# EasyEDA Pro project Vue receiver v1.0.epro

# Board PCB2
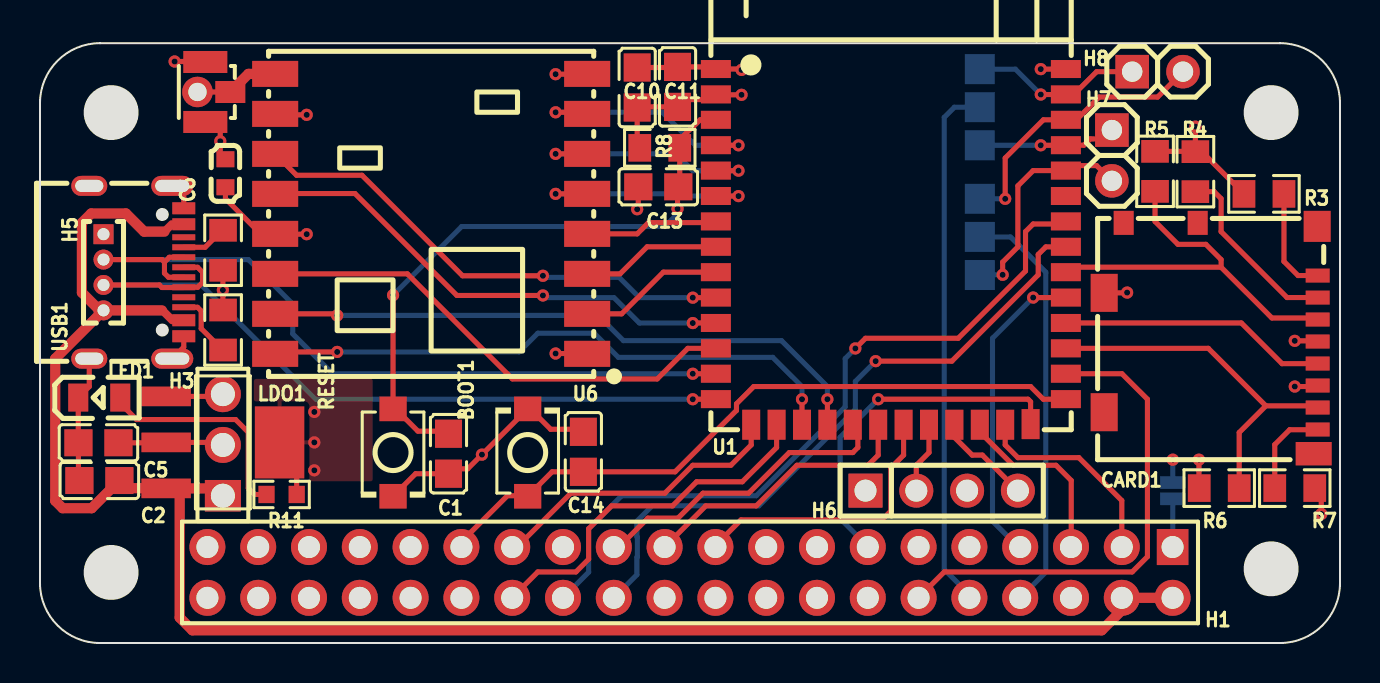
[diagram p0: board, top side]
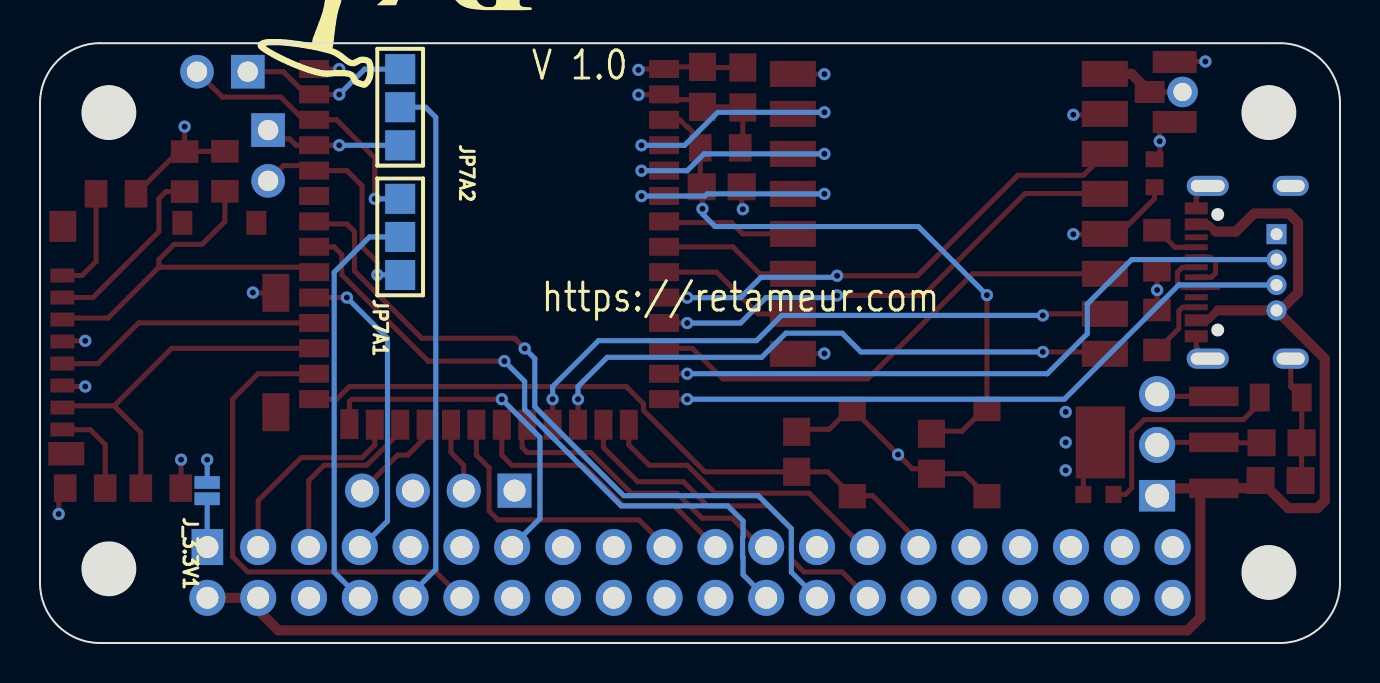
[diagram p1: board, bottom side, seen from below]

Outline 65 x 30 mm; copper layers: Top Layer, Inner1, Inner2, Bottom Layer. Coordinates in mm from the lower left corner of the outline.
Outline path: 0,27 0,3 arc(0.88,0.88) 3,0 62,0 arc(64.12,0.88) 65,3 65,27 arc(64.12,29.12) 62,30 3,30 arc(0.88,29.12) 0,27
Stack: Top Layer 0.035mm Outer layer copper thickness 1oz / Dielectric1 0.2104mm 7628 RC49% 8.6mil / Inner1 0.0152mm Inner layer copper thickness / Dielectric2 1.065mm 1.1mm H/HOZ Copper / Inner2 0.0152mm Inner layer copper thickness / Dielectric3 0.2104mm 7628 RC49% 8.6mil / Bottom Layer 0.035mm Outer layer copper thickness 1oz

## Design rules (mm)
net D-: DP1
net D+: DP1
template: Custom Config
spacing copperThickness1oz (default): track to track 0.102, other pairs 0.152 to 0.3
spacing copperThickness2oz: track to track 0.203, other pairs 0.152 to 0.3
track width copperThickness1oz (default): min 0.127, default 0.254, max 2.54
track width copperThickness2oz: min 0.203, default 0.254, max 2.54
differential pair differentialPair (default): width min 0.127, default 0.254, max 2.54; gap min 0.152, default 0.152
via viaSize (default): diameter min 0.5, default 0.61, max 10; hole min 0.3, default 0.305, max 6.3

## Placement (name value [footprint] x y rotation side)
BOOT1  TS-1088-AR02016  [SW-SMD_L3.9-W3.0-P4.45]  24.38 9.53 90 top
C1  100nF  [C0805]  20.43 9.47 90 top
C2  1uF  [C0805]  2.97 8.13 180 top
C5  4.7nF  [C0805]  2.92 10.01 180 top
C6  100nF  [C0603]  9.27 23.5 90 top
C10  100nF  [C0805]  29.86 27.78 270 top
C11  10uF  [C0805]  31.88 27.81 270 top
C13  1uF  [C0805]  30.91 22.82 0 top
C14  100nF  [C0805]  27.17 9.56 270 top
CARD1  1040310811  [SIM-SMD_8P-1040310811]  58.55 15.24 90 top
H1  2.54mm 2*20P直排针  [HDR-TH_40P-P2.54-V-M-R2-C20-S2.54]  32.5 3.53 180 top
H3  2.54-1*3P针  [HDR-TH_3P-P2.54-V-M-1]  9.14 9.91 90 top
H5  PZ127V-11-04-0720  [HDR-TH_4P-P1.27-V-M]  3.17 18.54 270 top
H6  PZ254V-11-04P  [HDR-TH_4P-P2.54-V-M]  45.09 7.62 0 top
H7  -  [PIN HEADER 1X2]  53.59 25.65 270 top
H8  -  [PIN HEADER 1X2]  54.61 28.58 0 top
J_3.3V1  J_3.3V  [SPARKFUN-JUMPERS_SMT-JUMPER_2_NC_PASTE_NO-SILK]  56.64 7.62 90 bottom
JP1  U.FL-R-SMT-1(10)  [ANT-SMD_UFL-R-SMT-1-10]  8.89 27.56 180 top
JP7A1  -  [Raemixx500:Jumper3-Open]  46.99 20.31 90 bottom
JP7A2  -  [Raemixx500:Jumper3-Open]  46.99 26.8 90 bottom
LDO1  LDL1117S33R  [SOT-223-4_L6.5-W3.5-P2.30-LS7.0-BR]  9.14 10.03 180 top
LED1  NCD0805R1  [LED0805-R-RD]  2.96 12.27 0 top
NOREF  -  [Pad_e790]  7.87 27.56 0 top
R3  10kΩ  [R0805]  61.2 22.46 0 top
R4  10kΩ  [R0805]  57.77 23.57 270 top
R5  10kΩ  [R0805]  55.75 23.59 270 top
R6  10kΩ  [R0805]  58.96 7.75 0 top
R7  10kΩ  [R0805]  62.74 7.75 180 top
R8  10kΩ  [R0805]  30.99 24.77 0 top
R9  5.1Ω  [R0805]  9.15 15.65 270 top
R10  5.1Ω  [R0805]  9.15 19.64 270 top
R11  1kΩ  [R0603]  12.08 7.43 180 top
RESET  TS-1088-AR02016  [SW-SMD_L3.9-W3.0-P4.45]  17.65 9.53 270 top
U1  ESP32-S3-WROOM-1-N16R8  [WIRELM-SMD_ESP32-S3-WROOM-1]  42.54 19.81 0 top
U2  d80a42be568847e5bce024f4a243b5a7  [MOUNTING-HOLE-M2.5]  3.56 3.53 0 top
U3  d80a42be568847e5bce024f4a243b5a7  [MOUNTING-HOLE-M2.5]  3.56 26.53 0 top
U4  d80a42be568847e5bce024f4a243b5a7  [MOUNTING-HOLE-M2.5]  61.56 26.53 0 top
U5  d80a42be568847e5bce024f4a243b5a7  [MOUNTING-HOLE-M2.5]  61.56 3.71 0 top
U6  DL-RFM69HC-868M  [WIFIM-SMD_16P-L16.0-W16.0-P2.00]  19.56 21.46 90 top
USB1  TYPE-C 16PIN 3MD(385)  [USB-C-SMD_TYPE-C16PIN]  4.83 18.54 270 top

## Footprints (pads in the part's own frame, mm; a bottom-side part is the same pattern mirrored in y, then rotated)
ANT-SMD_UFL-R-SMT-1-10
  rect 2.2x1.1 smd: 1(0.625,1.5) 3(0.625,-1.5)
  rect 1.5x1.1 smd: 2(-0.625,0.001)
C0603
  rect 0.8x0.9 smd: 1(-0.7,0) 2(0.7,0)
C0805
  rect 1.41x1.35 smd: 1(-1,0) 2(1,0)
HDR-TH_3P-P2.54-V-M-1
  rect 1.575x1.8 hole 1.2: 1(-2.54,0)
  round 1.8 hole 1.2: 2(0,0) 3(2.54,0)
HDR-TH_4P-P1.27-V-M
  rect 1x1 hole 0.6: 1(-1.905,0)
  round 1 hole 0.6: 2(-0.635,0) 3(0.635,0) 4(1.905,0)
HDR-TH_4P-P2.54-V-M
  rect 1.7x1.7 hole 1.1: 1(-3.81,0)
  round 1.7 hole 1.1: 2(-1.27,0) 3(1.27,0) 4(3.81,0)
HDR-TH_40P-P2.54-V-M-R2-C20-S2.54
  rect 1.575x1.8 hole 1.1: 1(-24.13,-1.27)
  round 1.8 hole 1.1: 2(-24.13,1.27) 3(-21.59,-1.27) 4(-21.59,1.27) 5(-19.05,-1.27) 6(-19.05,1.27) 7(-16.51,-1.27) 8(-16.51,1.27) 9(-13.97,-1.27) 10(-13.97,1.27) 11(-11.43,-1.27) 12(-11.43,1.27) 13(-8.89,-1.27) 14(-8.89,1.27) 15(-6.35,-1.27) 16(-6.35,1.27) 17(-3.81,-1.27) 18(-3.81,1.27) 19(-1.27,-1.27) 20(-1.27,1.27) 21(1.27,-1.27) 22(1.27,1.27) 23(3.81,-1.27) 24(3.81,1.27) 25(6.35,-1.27) 26(6.35,1.27) 27(8.89,-1.27) 28(8.89,1.27) 29(11.43,-1.27) 30(11.43,1.27) 31(13.97,-1.27) 32(13.97,1.27) 33(16.51,-1.27) 34(16.51,1.27) 35(19.05,-1.27) 36(19.05,1.27) 37(21.59,-1.27) 38(21.59,1.27) 39(24.13,-1.27) 40(24.13,1.27)
LED0805-R-RD
  rect 1x1.399 smd: 1(1.05,0) 2(-1.05,0)
Pad_e790
  round 1.524 hole 0.914: 1(0,0)
PIN HEADER 1X2
  rect 1.677x1.677 hole 1.016: 1(0,0)
  round 1.677 hole 1.016: 2(2.54,0)
R0603
  rect 0.806x0.864 smd: 1(-0.753,0) 2(0.753,0)
R0805
  rect 1.133x1.377 smd: 1(-1,0) 2(1,0)
Raemixx500:Jumper3-Open
  rect 1.5x1.5 smd: 1(-1.905,0) 2(0,0) 3(1.905,0)
SIM-SMD_8P-1040310811
  rect 0.7x1.2 smd: 1(3.138,-5.338) 2(2.038,-5.338) 3(0.938,-5.338) 4(-0.163,-5.338) 5(-1.262,-5.338) 6(-2.362,-5.338) 7(-3.462,-5.338) 8(-4.562,-5.338)
  rect 1.17x1.8 smd: 9(-5.772,-5.138)
  rect 1.55x1.35 smd: 10(5.598,-5.312)
  rect 1.2x1 smd: 11(5.772,0.662) 12(5.772,4.362)
  rect 1.9x1.35 smd: 13(2.272,5.338) 14(-3.697,5.338)
SOT-223-4_L6.5-W3.5-P2.30-LS7.0-BR
  rect 2.47x0.98 smd: 1(2.835,-2.3) 2(2.835,0) 3(2.835,2.3)
  rect 2.47x3.6 smd: 4(-2.835,0)
SPARKFUN-JUMPERS_SMT-JUMPER_2_NC_PASTE_NO-SILK
  custom 0.635x1.27 smd: 1(-0.406,0) 2(0.406,0)
SW-SMD_L3.9-W3.0-P4.45
  rect 1.23x1.36 smd: 1(-2.185,0) 2(2.185,0)
USB-C-SMD_TYPE-C16PIN
  oval 1x2.1 hole 0.6x1.7: 1(-4.32,1.788) 2(4.32,1.788)
  oval 1x1.8 hole 0.6x1.4: 3(-4.32,-2.362) 4(4.32,-2.362)
  rect 0.6x1.15 smd: A1B12(-3.2,2.362) A4B9(-2.4,2.362) B1A12(3.2,2.362) B4A9(2.4,2.362)
  rect 0.3x1.15 smd: A5(-1.25,2.362) A6(-0.25,2.362) A7(0.25,2.362) A8(-1.75,2.362) B5(1.75,2.362) B6(0.75,2.362) B7(-0.75,2.362) B8(1.25,2.362)
WIFIM-SMD_16P-L16.0-W16.0-P2.00
  rect 1.3x2.3 smd: 1(-7,-7.8) 2(-5,-7.8) 3(-3,-7.8) 4(-1,-7.8) 5(1,-7.8) 6(3,-7.8) 7(5,-7.8) 8(7,-7.8) 9(7,7.8) 10(5,7.8) 11(3,7.8) 12(1,7.8) 13(-1,7.8) 14(-3,7.8) 15(-5,7.8) 16(-7,7.8)
WIRELM-SMD_ESP32-S3-WROOM-1
  rect 1.5x0.9 smd: 1(-8.75,8.895) 2(-8.75,7.625) 3(-8.75,6.355) 4(-8.75,5.085) 5(-8.75,3.815) 6(-8.75,2.545) 7(-8.75,1.275) 8(-8.75,0.005) 9(-8.75,-1.265) 10(-8.75,-2.535) 11(-8.75,-3.805) 12(-8.75,-5.075) 13(-8.75,-6.345) 14(-8.75,-7.615) 27(8.75,-7.615) 28(8.75,-6.345) 29(8.75,-5.075) 30(8.75,-3.805) 31(8.75,-2.535) 32(8.75,-1.265) 33(8.75,0.005) 34(8.75,1.275) 35(8.75,2.545) 36(8.75,3.815) 37(8.75,5.085) 38(8.75,6.355) 39(8.75,7.625) 40(8.75,8.895)
  rect 0.9x1.5 smd: 15(-6.985,-8.895) 16(-5.715,-8.895) 17(-4.445,-8.895) 18(-3.175,-8.895) 19(-1.905,-8.895) 20(-0.635,-8.895) 21(0.635,-8.895) 22(1.905,-8.895) 23(3.175,-8.895) 24(4.445,-8.895) 25(5.715,-8.895) 26(6.985,-8.865)

## Nets
+3.3V: C5.1 C6.1 C10.2 C11.2 CARD1.4 H3.2 H6.1 J_3.3V1.2 LDO1.2 LDO1.4 R3.1 R4.1 R5.1 R6.1 R7.1 R8.1 R11.1 U1.2 U6.13
+5V: C2.1 H1.2 H1.4 H3.1 H5.4 LDO1.3 USB1.A4B9 USB1.B4A9
GND: BOOT1.2 C1.1 C2.2 C5.2 C6.2 C10.1 C11.1 C13.1 C14.1 CARD1.6 CARD1.13 H1.6 H1.9 H1.14 H1.20 H1.25 H1.30 H1.34 H1.39 H3.3 H5.1 H6.3 JP1.1 JP1.3 LDO1.1 LED1.2 R9.1 R10.2 RESET.2 U1.1 U1.40 U6.1 U6.8 U6.10 USB1.1 USB1.2 USB1.3 USB1.4 USB1.A1B12 USB1.B1A12
1_WIRE: H1.7 U1.31
ANT: JP1.2 NOREF.1 U6.9
BRIGDE_3.3: H1.1 H1.17 J_3.3V1.1
D+: H5.3 U1.14 USB1.A6 USB1.B6
D-: H5.2 U1.13 USB1.A7 USB1.B7
DIO0: U1.12 U6.14
DIO1: U1.18 U6.15
DIO2: U1.17 U6.16
DIO3: U1.10 U6.11
DIO4: U1.11 U6.12
DIO5: U1.4 U6.7
EN: C1.2 C13.2 R8.2 RESET.1 U1.3
GPIO0: BOOT1.1 C14.2 H1.29 U1.27
GPIO3: H1.27 U1.15
GPIO14: H6.2 U1.22
GPIO21: H6.4 U1.23
GPIO35: H1.12 U1.28
GPIO45: H1.13 U1.26
GPIO46: H1.28 U1.16
I2C_SCL1: H1.5 U1.24
I2C_SDA0: H1.3 U1.25
MISO: U1.9 U6.2
MOSI: U1.8 U6.3
RESET: U1.5 U6.6
RXD0: H7.2 JP7A1.1 U1.36
RXD1: H8.2 JP7A1.3 U1.38
SCK: U1.7 U6.4
SD_CLK: CARD1.5 U1.30
SD_CMD: CARD1.3 R5.2 U1.32
SD_DATA0: CARD1.7 R6.2 U1.29
SPI2_CS0: H1.24 U1.33
SPI2_CS1: H1.26 U1.34
SPI2_MISO: H1.21 U1.20
SPI2_MOSI: H1.19 U1.21
SPI2_SCLK: H1.23 U1.19
SS: U1.6 U6.5
TXD0: H7.1 JP7A2.1 U1.37
TXD1: H8.1 JP7A2.3 U1.39
$1N677: H1.11
$1N3033: CARD1.8 R7.2
$1N3034: CARD1.2 R4.2
$1N3035: CARD1.1 R3.2
$1N3426: R10.1 USB1.A5
$1N3427: R9.2 USB1.B5
$1N3817: LED1.1 R11.2
$1N4970: H1.8 JP7A1.2
$1N4972: H1.10 JP7A2.2

Pads without a net: CARD1 9 10 11 12 14; H1 15 16 18 22 31 32 33 35 36 37 38 40; U1 35; USB1 A8 B8

## Via types
v1: diameter 0.61, hole 0.305, Top Layer to Bottom Layer, 48 vias

## Routing (per net, layer and track width the routed paths; a pad name or vN(x,y) marks a point on that pad's centre or on a via; arc(x,y) is an arc through that point)
+3.3V: length 32.9
  Top Layer w0.254: H3.2 9.02,10.03 6.31,10.03 6.29,10.01 C5.1 ; R8.1 29.86,24.89 C10.2 29.89,26.81 C11.2 32.24,27.18 33.54,27.18 U1.2 33.81,27.42 v1(35.08,27.42) ; v1(64.06,6.45) 64.06,7.42 R7.1 ; LDO1.4 12.83,9.18 R11.1 ; R3.1 58.09,24.57 R4.1 ; R4.1 v1(57.77,25.83) ; R4.1 57.75,24.59 R5.1 ; C6.1 9.27,22.22 11.03,20.46 U6.13 11.77,20.45 v1(13.34,20.45) ; R6.1 57.95,7.76 v1(57.95,9.17) ; v1(62.74,15.11) 63.92,15.11
  Bottom Layer w0.254: v1(56.64,9.17) J_3.3V1.2
  vias: v1(13.72,11.56) v1(13.72,10.03) v1(13.72,8.64)
+5V: length 90.5
  Top Layer w0.4: 6.12,16.64 6.62,16.14 ; 6.59,20.94 6.22,20.57
  Top Layer w0.508: C2.1 2.58,6.74 1.13,6.74 0.76,7.11 0.76,14.22 H5.4 ; H5.4 6.1,16.64 ; H5.4 2.98,16.64 2.1,17.53 2.1,21.02 2.56,21.48 4.3,21.48 5.21,20.57 6.22,20.57 ; 6.31,7.73 8.78,7.73 H3.1 ; H1.2 H1.4 54.09,1.64 53.09,0.64 7.62,0.64 6.98,1.27 6.98,7.24 ; 3.97,7.74 6.3,7.74
GND: length 43.7
  Top Layer w0.254: C10.1 31.85,28.78 C11.1 33.69,28.81 U1.1 35.03,28.71 v1(35.08,28.66) ; CARD1.13 54.34,17.51 v1(54.36,17.53) ; 9.03,16.65 9.15,16.77 9.15,18.52 9.03,18.64 ; U6.8 27.34,28.45 v1(25.78,28.45) ; v1(29.86,21.69) 29.91,21.75 C13.1 ; 6.31,12.33 9.03,12.33 H3.3 ; USB1.1 7.19,22.29 USB1.A1B12 ; USB1.2 7.19,14.8 USB1.B1A12 ; U6.1 27.34,14.48 v1(25.78,14.48) ; C1.1 18.78,8.47 RESET.2 ; C6.2 9.01,24.45 v1(9.01,25.09) 9.01,25.91 ; v1(13.34,26.42) 11.81,26.42 U6.10 ; USB1.4 2.46,12.83 LED1.2 1.91,10.02 C5.2 1.92,7.79 1.97,7.74 ; 24.38,11.84 25.53,10.69 27.17,10.69 ; JP1.3 8.24,29.08 v1(6.73,29.08) ; v1(62.74,12.83) 63.96,12.83 ; v1(50.04,28.7) 51.29,28.7 U1.40 ; 21.03,8.71 21.39,8.71 v1(22.1,9.42) BOOT1.2
  vias: v1(9.14,17.65)
1_WIRE: length 15.6
  Top Layer w0.254: U1.31 v1(49.66,17.28)
  Bottom Layer w0.254: v1(49.66,17.28) 47.62,15.25 47.62,6.1 48.92,4.8 49.01,4.8
ANT: length 4.3
  Top Layer w0.254: JP1.2 7.88,27.56
  Top Layer w0.508: JP1.2 10.42,28.46 U6.9
BRIGDE_3.3: length 23.8
  Inner2 w0.254: 36.31,4.8 36.31,4.71 37.47,3.56 55.39,3.56 56.63,4.8
  Bottom Layer w0.254: J_3.3V1.1 56.64,4.81 56.63,4.8
D+: length 39.7
  Top Layer w0.254: v1(32.64,12.19) 33.79,12.19 U1.14 ; H5.3 5.97,17.91 6.1,17.78 7.18,17.78 USB1.B6 7.89,17.79 8.13,18.03 8.13,18.54 7.88,18.79 USB1.A6
  Bottom Layer w0.254: v1(32.64,12.19) 13.78,12.19 8.06,17.91 H5.3
D-: length 39.6
  Top Layer w0.254: 6.22,19.05 6.1,19.18 H5.2 ; 6.22,19.05 6.47,19.29 USB1.B7 ; 6.22,19.05 6.22,18.5 6.43,18.29 USB1.A7 ; U1.13 v1(32.64,13.47)
  Bottom Layer w0.254: v1(32.64,13.47) 14.63,13.47 12.64,15.46 12.64,16.95 10.41,19.18 H5.2
DIO0: length 24.8
  Top Layer w0.254: U1.12 32.39,14.74 30.86,13.21 23.62,13.21 18.37,18.46 U6.14
DIO1: length 31
  Top Layer w0.254: v1(39.37,12.19) U1.18 ; v1(14.86,16.38) 14.78,16.46 U6.15
  Bottom Layer w0.254: v1(39.37,12.19) 39.37,12.83 37.07,15.12 29.17,15.12 27.91,16.38 v1(14.86,16.38)
DIO2: length 29.8
  Top Layer w0.254: U6.16 11.85,14.56 v1(14.86,14.56) ; v1(38.1,12.19) U1.17
  Bottom Layer w0.254: v1(14.86,14.56) 23.96,14.56 24.89,15.49 27.71,15.49 28.92,14.29 36.64,14.29 38.1,12.83 v1(38.1,12.19)
DIO3: length 25
  Top Layer w0.254: v1(32.64,17.27) 33.79,17.27 U1.10 ; v1(25.15,18.37) 21.13,18.37 16.1,23.39 12.83,23.39 U6.11
  Bottom Layer w0.254: v1(32.64,17.27) 29.97,17.27 28.96,18.29 25.22,18.29 v1(25.15,18.37)
DIO4: length 24.7
  Top Layer w0.254: 33.79,16.01 32.64,16.01 v1(32.64,16) ; U6.12 11.77,22.48 15.75,22.48 20.84,17.38 v1(25.15,17.38)
  Bottom Layer w0.254: v1(32.64,16) 29.97,16 28.7,17.27 25.26,17.27 v1(25.15,17.38)
DIO5: length 12.6
  Top Layer w0.254: v1(25.78,26.54) 27.28,26.54 U6.7 ; U1.4 33.8,24.89 v1(34.93,24.89)
  Bottom Layer w0.254: v1(25.78,26.54) 31.12,26.54 32.77,24.89 v1(34.93,24.89)
EN: length 30.7
  Top Layer w0.254: 17.65,11.84 v1(17.65,17.4) ; 17.65,11.84 18.9,10.59 20.43,10.59 ; 17.65,11.84 RESET.1 ; U1.3 33.01,26.17 32.67,25.83 32.64,25.83 31.79,24.97 31.99,24.77 31.99,23.11 ; v1(31.88,21.72) 31.88,22.78 C13.2
  Bottom Layer w0.254: v1(31.88,21.72) 31.88,21.46 31.24,20.83 21.08,20.83 v1(17.65,17.4)
GPIO0: length 34.2
  Top Layer w0.254: 21.07,4.8 21.07,5.07 23.37,7.37 24.36,7.37 BOOT1.1 25.61,8.56 C14.2 31.75,8.56 34.82,11.63 34.82,11.96 35.69,12.83 49.53,12.83 50.16,12.19 51.29,12.19 U1.27
GPIO3: length 15.6
  Top Layer w0.254: U1.15 35.56,9.91 34.54,8.89 32.64,8.89 31.24,7.49 26.54,7.49 23.85,4.8 23.61,4.8 23.61,5.32
GPIO14: length 3.6
  Top Layer w0.254: H6.2 43.81,8.89 44.45,9.53 U1.22
GPIO21: length 4.9
  Top Layer w0.254: U1.23 45.72,10.29 46.61,9.4 47.12,9.4 H6.4
GPIO35: length 24.8
  Top Layer w0.254: H1.12 43.93,2.27 45.21,3.56 54.61,3.56 55.37,4.32 55.37,12.19 54.1,13.47 U1.28
GPIO45: length 17.5
  Top Layer w0.254: U1.26 49.53,12.06 49.4,12.19 v1(41.91,12.19)
  Bottom Layer w0.254: v1(41.91,12.19) 40,10.29 40,6.22 41.39,4.84 41.39,4.8
GPIO46: length 18.4
  Top Layer w0.254: H1.28 23.61,2.27 24.89,3.56 26.8,3.56 27.43,4.19 27.43,5.72 28.57,6.86 31.62,6.86 32.83,8.06 35.12,8.06 36.83,9.78 U1.16
I2C_SCL1: length 9.3
  Top Layer w0.254: U1.24 46.99,10.56 48.66,8.89 50.8,8.89 51.56,8.13 51.56,4.81 51.55,4.8
I2C_SDA0: length 10.3
  Top Layer w0.254: U1.25 48.26,9.91 48.9,9.27 51.94,9.27 54.09,7.12 54.09,4.8
MISO: length 7.3
  Top Layer w0.254: U6.2 29.08,16.46 31.17,18.55 U1.9
MOSI: length 7
  Top Layer w0.254: U6.3 29,18.46 30.36,19.82 U1.8
RESET: length 12.2
  Top Layer w0.254: v1(34.93,23.62) 33.8,23.62 U1.5 ; U6.6 v1(25.78,24.46)
  Bottom Layer w0.254: v1(25.78,24.46) 31.8,24.46 32.64,23.62 v1(34.93,23.62)
RXD0: length 11.3
  Top Layer w0.254: H7.2 52.83,23.88 51.54,23.88 U1.36 49.66,23.63 48.9,22.86 48.9,19.81 48.13,19.05 v1(48.13,18.42)
  Bottom Layer w0.254: JP7A1.1 47,18.42 v1(48.13,18.42)
RXD1: length 14
  Top Layer w0.254: H8.2 55.88,27.31 52.96,27.31 51.82,26.17 U1.38 50.17,26.17 48.26,24.26 v1(48.26,22.21)
  Bottom Layer w0.254: JP7A1.3 v1(48.26,22.21)
SCK: length 6.7
  Top Layer w0.254: U6.4 29.86,20.46 30.42,21.03 33.73,21.03 U1.7
SD_CLK: length 13.4
  Top Layer w0.254: CARD1.5 63.88,13.97 62.1,13.97 60.07,16.01 51.29,16.01
SD_CMD: length 19.8
  Top Layer w0.254: 59.06,18.8 61.59,16.26 63.81,16.26 CARD1.3 ; 59.06,18.8 51.54,18.8 U1.32 ; 59.06,18.8 59.06,19.18 58.29,19.94 56.9,19.94 55.75,21.08 R5.2
SD_DATA0: length 18
  Top Layer w0.254: 61.29,11.86 59.96,10.53 59.96,8.25 ; 61.29,11.86 58.41,14.74 U1.29 ; 61.29,11.86 63.8,11.86 CARD1.7
SPI2_CS0: length 32.9
  Top Layer w0.254: v1(41.78,14.1) 45.59,14.1 49.91,18.42 49.91,19.43 50.29,19.81 51.29,19.81 U1.33
  Bottom Layer w0.254: H1.24 29.84,3.41 29.84,4.29 29.87,4.31 29.87,5.29 29.84,5.31 29.84,6.1 30.61,6.86 35.94,6.86 40.77,11.68 40.77,13.08 v1(41.78,14.1)
SPI2_CS1: length 36.8
  Top Layer w0.254: v1(40.77,14.73) 41.28,15.24 45.91,15.24 49.28,18.61 49.28,20.57 49.66,20.95 51.16,20.95 U1.34
  Bottom Layer w0.254: H1.26 27.43,3.54 27.43,5.72 29.08,7.37 35.81,7.37 40.26,11.81 40.26,14.22 v1(40.77,14.73)
SPI2_MISO: length 14.1
  Top Layer w0.254: U1.20 41.91,9.4 41.4,8.89 37.85,8.89 35.81,6.86 33.29,6.86 ; 33.29,6.86 31.23,4.8
SPI2_MOSI: length 14.1
  Top Layer w0.254: U1.21 43.18,9.4 42.54,8.76 42.54,6.6 42.1,6.16 35.05,6.16 33.77,4.88 33.77,4.8
SPI2_SCLK: length 15.5
  Top Layer w0.254: U1.19 40.89,10.66 40.89,9.78 40.64,9.53 37.47,9.53 35.43,7.49 33.15,7.49 31.9,6.25 30.39,6.25 28.94,4.8 28.69,4.8
SS: length 11.9
  Top Layer w0.254: v1(34.93,22.35) 33.8,22.35 U1.6 ; U6.5 v1(25.78,22.46)
  Bottom Layer w0.254: v1(25.78,22.46) 31.64,22.46 31.75,22.35 v1(34.93,22.35)
TXD0: length 5.8
  Top Layer w0.254: 52.71,25.21 52.51,25.21 52.2,24.9 U1.37 51.29,24.89 v1(50.04,24.89)
  Bottom Layer w0.254: JP7A2.1 v1(50.04,24.89)
TXD1: length 8.6
  Top Layer w0.254: H8.1 52.83,28.58 51.69,27.44 U1.39 51.29,27.43 v1(50.04,27.43)
  Bottom Layer w0.254: v1(50.04,27.43) 48.77,28.7 JP7A2.3
$1N3033: length 4.6
  Top Layer w0.254: R7.2 61.74,9.92 62.48,10.67 63.88,10.67 CARD1.8
$1N3034: length 9.3
  Top Layer w0.254: CARD1.2 62.35,17.28 59.06,20.57 59.06,22.22 58.71,22.57 R4.2
$1N3035: length 5.4
  Top Layer w0.254: CARD1.1 62.9,18.38 62.2,19.08 R3.2
$1N3426: length 2.2
  Top Layer w0.254: USB1.A5 8.25,19.79 9.03,20.56 9.03,20.64
$1N3427: length 3.3
  Top Layer w0.254: 9.03,14.65 9.03,14.76 8.06,15.73 8.06,16.61 7.87,16.79 USB1.B5
$1N3817: length 11.1
  Top Layer w0.254: LED1.1 4.01,11.99 4.83,11.18 9.78,11.18 10.41,10.54 10.41,7.75 10.73,7.43 R11.2
$1N4970: length 20.8
  Bottom Layer w0.254: H1.8 50.29,3.54 50.29,18.54 48.52,20.31 JP7A1.2
$1N4972: length 26.5
  Bottom Layer w0.254: H1.10 46.47,2.42 45.21,3.68 45.21,26.29 45.72,26.8 JP7A2.2

## Copper pours and planes (outline as drawn; the poured copper is in the pictures)
+3.3V on Top Layer: 10.7,13.21 16.64,13.21 16.64,8.09 10.7,8.09
+3.3V on Inner2: 0,30 65,30 65,0 0,0
GND on Inner1: 0,30 65,30 65,0 0,0

## Text on the board
Bottom Silkscreen Layer: https://retameur.com | V 1.0
